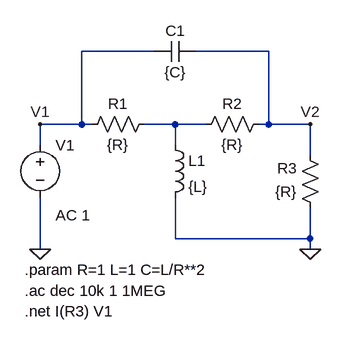
[diagram p0: schematic TS7_1.asc]
TS7_1.asc, the LTspice schematic file:
Version 4
SHEET 1 904 680
WIRE 160 0 48 0
WIRE 336 0 224 0
WIRE 48 112 48 0
WIRE 48 112 -16 112
WIRE 64 112 48 112
WIRE 192 112 144 112
WIRE 240 112 192 112
WIRE 336 112 336 0
WIRE 336 112 320 112
WIRE 400 112 336 112
WIRE -16 144 -16 112
WIRE 192 144 192 112
WIRE 400 160 400 112
WIRE 192 288 192 224
WIRE 400 288 400 240
WIRE 400 288 192 288
WIRE -16 304 -16 224
WIRE 400 304 400 288
FLAG -16 304 0
FLAG 400 304 0
FLAG 400 112 V2
FLAG -16 112 V1
SYMBOL res 160 96 R90
WINDOW 0 0 56 VBottom 2
WINDOW 3 32 56 VTop 2
SYMATTR InstName R1
SYMATTR Value {R}
SYMBOL res 336 96 R90
WINDOW 0 0 56 VBottom 2
WINDOW 3 32 56 VTop 2
SYMATTR InstName R2
SYMATTR Value {R}
SYMBOL res 416 256 R180
WINDOW 0 36 76 Left 2
WINDOW 3 36 40 Left 2
SYMATTR InstName R3
SYMATTR Value {R}
SYMBOL cap 224 -16 R90
WINDOW 0 0 32 VBottom 2
WINDOW 3 32 32 VTop 2
SYMATTR InstName C1
SYMATTR Value {C}
SYMBOL ind 176 128 R0
SYMATTR InstName L1
SYMATTR Value {L}
SYMBOL voltage -16 128 R0
WINDOW 123 24 124 Left 2
WINDOW 39 24 152 Left 2
SYMATTR InstName V1
SYMATTR Value ""
SYMATTR Value2 AC 1
TEXT -40 336 Left 2 !.param R=1 L=1 C=L/R**2
TEXT -40 368 Left 2 !.ac dec 10k 1 1MEG
TEXT -40 400 Left 2 !.net I(R3) V1

The netlist it stands for:
* TS7_1.asc
R1 N001 V1 {R}
R2 V2 N001 {R}
R3 0 V2 {R}
C1 V2 V1 {C}
L1 N001 0 {L}
V1 V1 0 AC 1
.param R=1 L=1 C=L/R**2
.ac dec 10k 1 1MEG
.net I(R3) V1
.backanno
.end